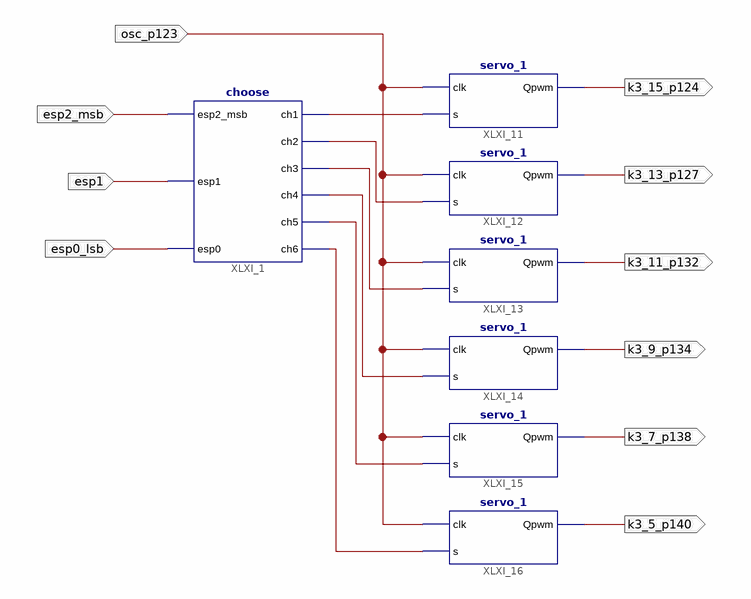
[diagram p0: schematic sheet 1]
// Xilinx ISE schematic locker.sch (spartan6) as structural Verilog: 7 symbols, 10 ports
module locker (
  input  osc_p123,
  input  esp2_msb,
  input  esp1,
  input  esp0_lsb,
  output k3_13_p127,
  output k3_11_p132,
  output k3_15_p124,
  output k3_9_p134,
  output k3_7_p138,
  output k3_5_p140
);

  wire XLXN_55, XLXN_56, XLXN_57, XLXN_58, XLXN_59, XLXN_60;

  choose XLXI_1 (
    .esp2_msb(esp2_msb), .esp1(esp1), .esp0(esp0_lsb), .ch1(XLXN_55), .ch2(XLXN_56), .ch3(XLXN_57),
    .ch4(XLXN_58), .ch5(XLXN_59), .ch6(XLXN_60));
  servo_1 XLXI_13 (.clk(osc_p123), .s(XLXN_57), .Qpwm(k3_11_p132));
  servo_1 XLXI_14 (.clk(osc_p123), .s(XLXN_58), .Qpwm(k3_9_p134));
  servo_1 XLXI_15 (.clk(osc_p123), .s(XLXN_59), .Qpwm(k3_7_p138));
  servo_1 XLXI_16 (.clk(osc_p123), .s(XLXN_60), .Qpwm(k3_5_p140));
  servo_1 XLXI_11 (.clk(osc_p123), .s(XLXN_55), .Qpwm(k3_15_p124));
  servo_1 XLXI_12 (.clk(osc_p123), .s(XLXN_56), .Qpwm(k3_13_p127));
endmodule
